# EAGLE design scanner154 (EAGLE 6.5.0)
AUTHOR: Brad Campbell; REV: A; TITLE: Scanner 15.4
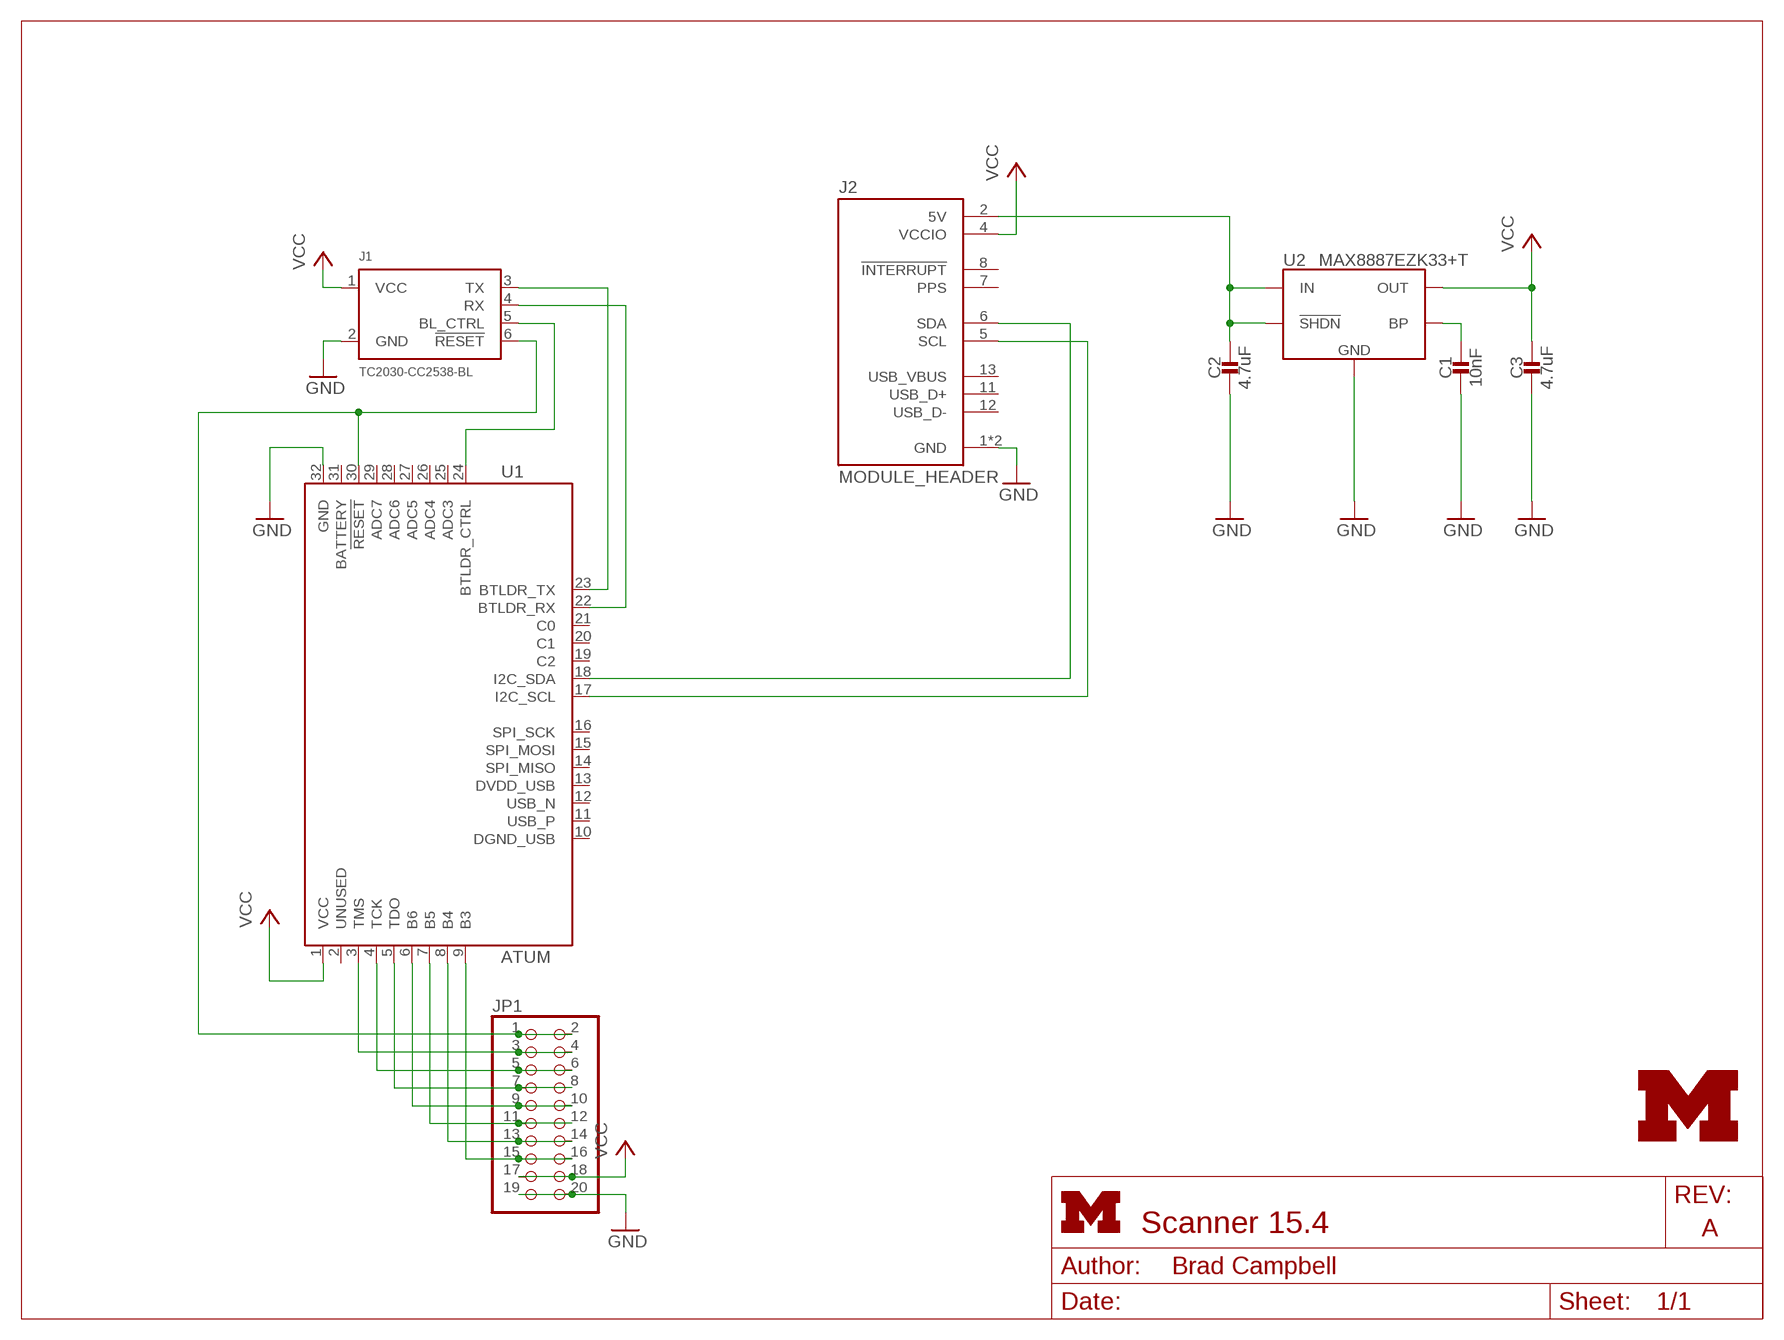
[diagram p0: schematic, sheet 1]
FRAME1 (LETTER_L): HEIGHT: 8.5in; WIDTH: 11in

## Parts
C1  10nF  CAPACITOR0603_CAP  [0603_CAP]
C2  4.7uF  CAPACITOR0603_CAP  [0603_CAP]
C3  4.7uF  CAPACITOR0603_CAP  [0603_CAP]
J1  TC2030-CC2538-BL  [TC2030-IDC]
J2  MODULE_HEADER  [HEADER_14PIN]
JP1  PINHD-2X10  [2X10]
LOGO2  UMICH_SOLID_HUGE  [UMICH_SOLID_500MIL]
U1  ATUM  [ATUM]
U2  MAX8887EZK33+T  [SOT-23-5]

## Nets
5V: C2.1 J2.2(5V) U2.1(IN) U2.3(!SHDN)
!RESET: J1.6(!RESET) JP1.1 JP1.2 U1.30(!RESET)
B3: JP1.15 JP1.16 U1.9(B3)
B4: JP1.13 JP1.14 U1.8(B4)
B5: JP1.11 JP1.12 U1.7(B5)
B6: JP1.9 JP1.10 U1.6(B6)
GND: C1.2 C2.2 C3.2 J1.2(GND) J2.1(GND) J2.14(GND) JP1.19 JP1.20 U1.32(GND) U2.2(GND)
N$5: J1.3(TX) U1.23(BTLDR_TX)
N$6: J1.4(RX) U1.22(BTLDR_RX)
N$7: J1.5(BL_CTRL) U1.24(BTLDR_CTRL)
N$11: C1.1 U2.4(BP)
SCL: J2.5(SCL) U1.17(I2C_SCL)
SDA: J2.6(SDA) U1.18(I2C_SDA)
TCK: JP1.5 JP1.6 U1.4(TCK)
TDO: JP1.7 JP1.8 U1.5(TDO)
TMS: JP1.3 JP1.4 U1.3(TMS)
VCC: C3.1 J1.1(VCC) J2.4(VCCIO) JP1.17 JP1.18 U1.1(VCC) U2.5(OUT)
Unconnected: J2.7(PPS) J2.8(!INTERRUPT) J2.11(USB_D+) J2.12(USB_D-) J2.13(USB_VBUS) U1.2(UNUSED) U1.10(DGND_USB) U1.11(USB_P) U1.12(USB_N) U1.13(DVDD_USB) U1.14(SPI_MISO) U1.15(SPI_MOSI) U1.16(SPI_SCK) U1.19(C2) U1.20(C1) U1.21(C0) U1.25(ADC3) U1.26(ADC4) U1.27(ADC5) U1.28(ADC6) U1.29(ADC7) U1.31(BATTERY)

## Library data of the parts
C1 = passives:CAPACITOR: 0402 Capacitor; DIGIKEY: 490-1512-1-ND
C2 C3 = passives:CAPACITOR: 0402 Capacitor; DIGIKEY: 490-3297-1-ND
J1 = connector:TC2030-CC2538-BL: Tag connect programmer for the CC2538 bootloader. The RX/TX switch happens on the programmer board, so when using this connect the TX pin to the TX pin on the CC2538 and same for the RX.
J2 = signpost:MODULE_HEADER: Header for signpost modules; DIGIKEY: S9170-ND
JP1 = pinhead:PINHD-2X10: PIN HEADER
LOGO2 = logos:UMICH_SOLID
U1 = atum:ATUM: Atum sensorboard prototyping module.
U2 = chips:MAX8887: IC REG LDO 3.3V 0.3A TSOT23-5; DIGIKEY: MAX8887EZK33+TCT-ND

## Board
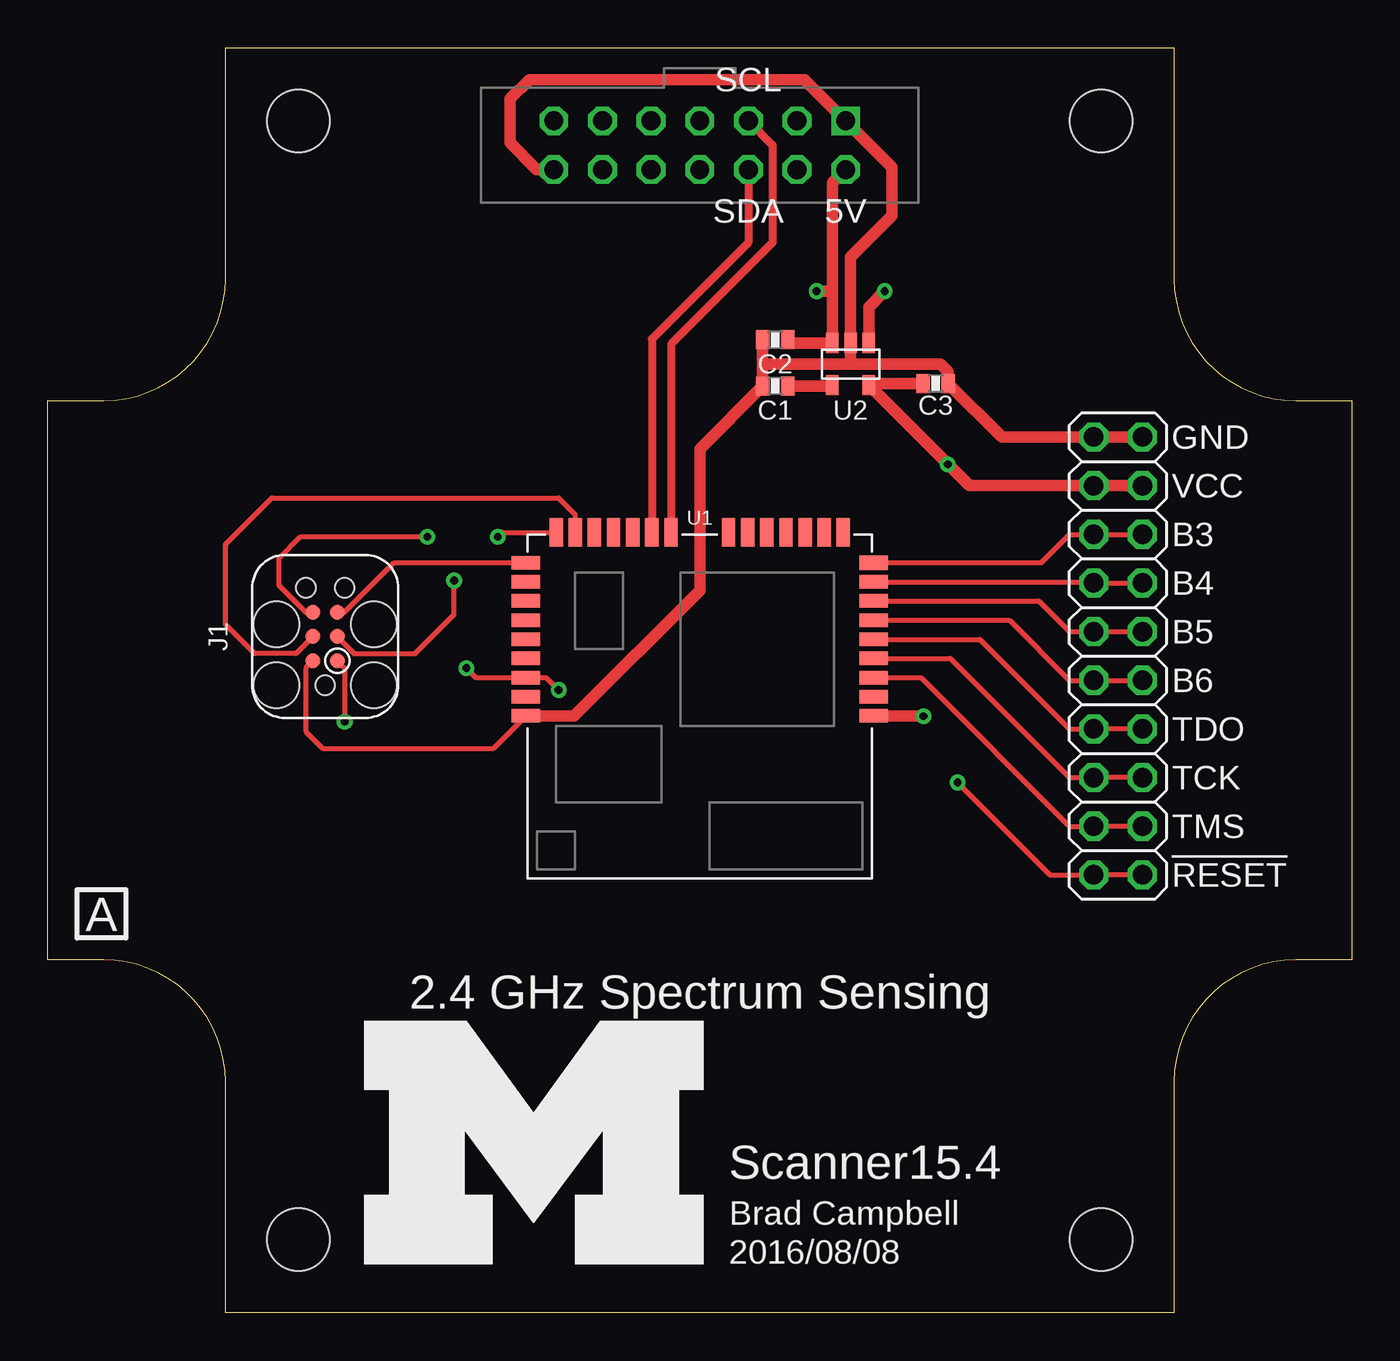
[diagram p1: board, top side]
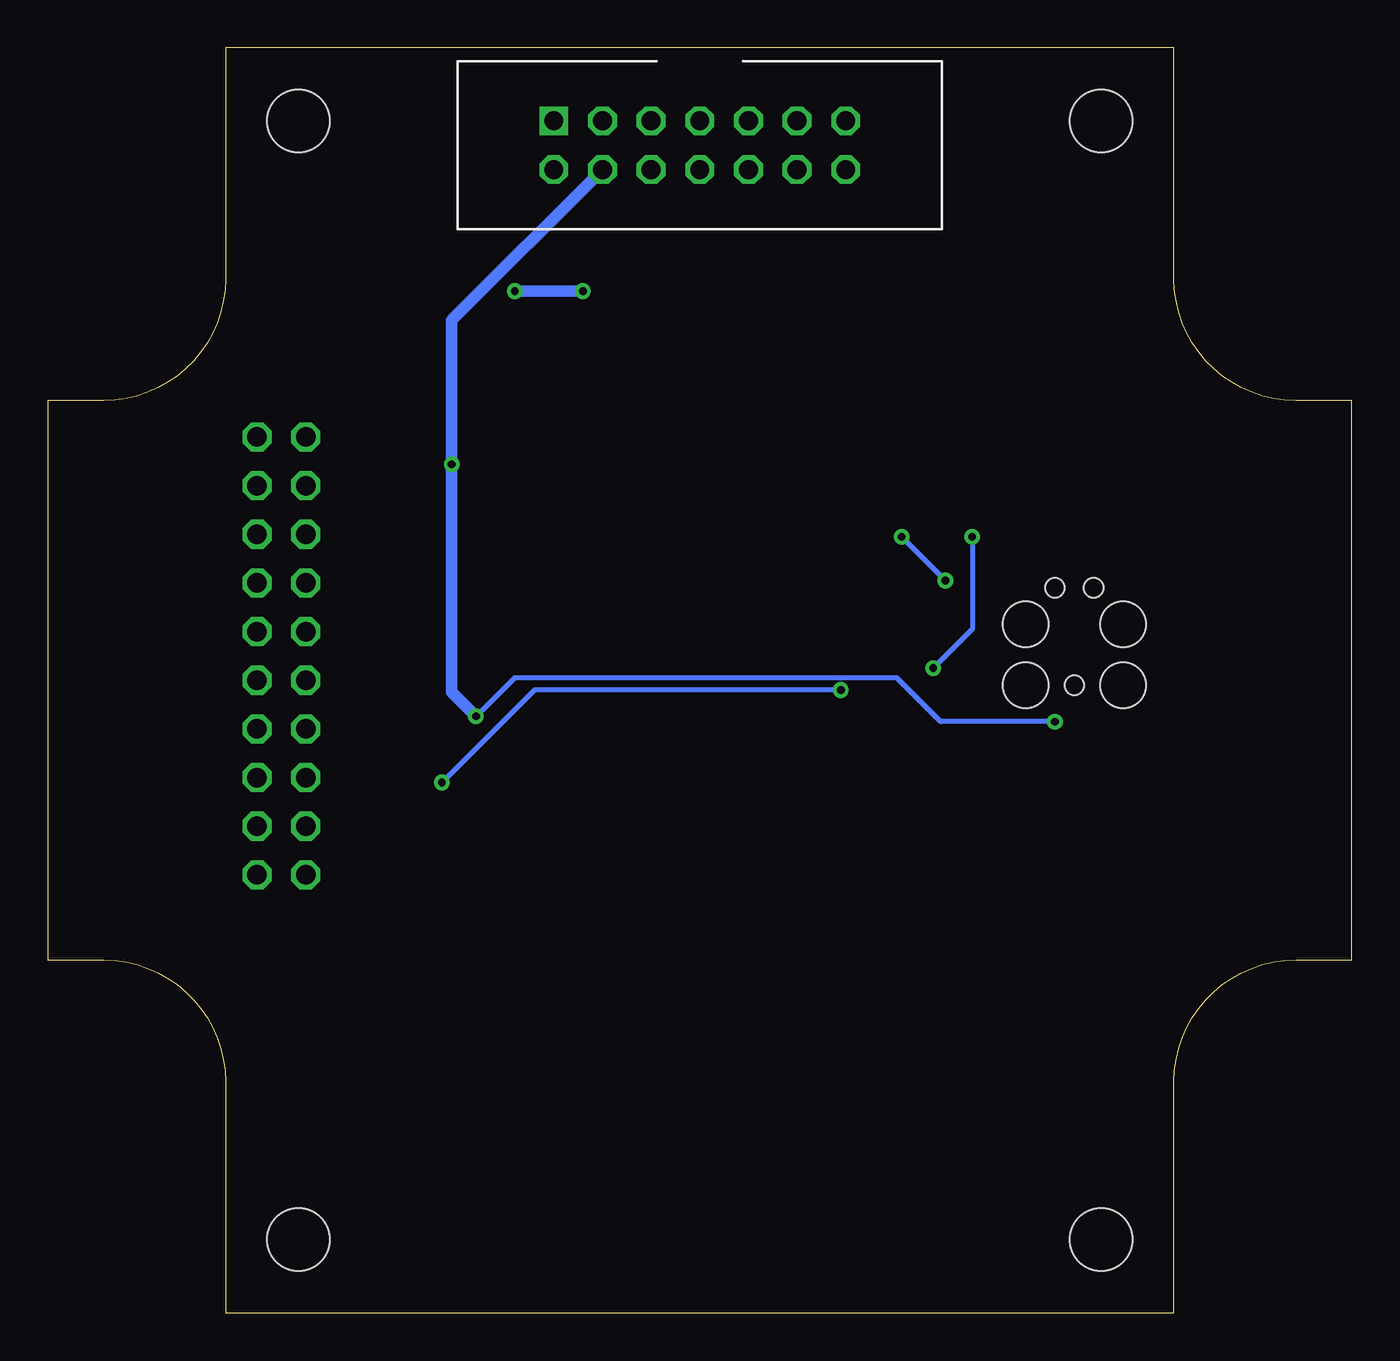
[diagram p2: board, bottom side, seen from below]

Size 68.07 x 66.04 mm. Coordinates in mm from the lower left corner, seen from the top.
Outline: 9.27,0 9.27,12.06 arc90 2.92,18.41 0,18.41 0,47.62 2.92,47.62 arc90 9.27,53.98 9.27,66.04 58.8,66.04 58.8,53.98 arc90 65.15,47.62 68.07,47.62 68.07,18.41 65.15,18.41 arc90 58.8,12.06 58.8,0 9.27,0
Copper layers (1*16): Top 0.035mm / dielectric 1.5mm / Bottom 0.035mm
Design rules "default": minimum track width 10mil, minimum drill 24mil, track to track 8mil, track to pad 8mil, pad to pad 8mil, via to via 8mil, smd to smd 8mil, copper to edge 40mil, drill to drill 8mil, minimum pad ring 10mil, minimum via ring 8mil, stop-mask expansion 4mil, vias tented up to drill 0mil, thermal gap 10mil
Holes 3.26 mm at 13.08,62.23 54.99,62.23 13.08,3.81 54.99,3.81

### Footprints (pad centres in the part's own frame; a part is rotated, then mirrored left to right if it is on the bottom)
0603_CAP = smd 0.7 x 1: 1 -0.65,0; 2 0.65,0
TC2030-IDC = smd 0.787 x 0.787: 1 -1.27,-0.635; 2 -1.27,0.635; 3 0,-0.635; 4 0,0.635; 5 1.27,-0.635; 6 1.27,0.635 | hole 2.375: -2.54,2.54; 0.635,2.54; 0.635,-2.54; -2.54,-2.54 | hole 1.016: -2.54,0; 2.54,1.016; 2.54,-1.016
HEADER_14PIN = drill 0.991 square: 1 7.62,1.27 | drill 0.991 octagon: 2 7.62,-1.27; 3 5.08,1.27; 4 5.08,-1.27; 5 2.54,1.27; 6 2.54,-1.27; 7 0,1.27; 8 0,-1.27; 9 -2.54,1.27; 10 -2.54,-1.27; 11 -5.08,1.27; 12 -5.08,-1.27; 13 -7.62,1.27; 14 -7.62,-1.27
2X10 = drill 1.016 octagon: 1 -11.43,-1.27; 2 -11.43,1.27; 3 -8.89,-1.27; 4 -8.89,1.27; 5 -6.35,-1.27; 6 -6.35,1.27; 7 -3.81,-1.27; 8 -3.81,1.27; 9 -1.27,-1.27; 10 -1.27,1.27; 11 1.27,-1.27; 12 1.27,1.27; 13 3.81,-1.27; 14 3.81,1.27; 15 6.35,-1.27; 16 6.35,1.27; 17 8.89,-1.27; 18 8.89,1.27; 19 11.43,-1.27; 20 11.43,1.27
ATUM = smd 0.7 x 1.5: 1 -9.479,-9.079; 2 -8.479,-9.079; 3 -7.479,-9.079; 4 -6.479,-9.079; 5 -5.479,-9.079; 6 -4.479,-9.079; 7 -3.479,-9.079; 8 -2.479,-9.079; 24 -1.479,9.079; 25 -2.479,9.079; 26 -3.479,9.079; 27 -4.479,9.079; 28 -5.479,9.079; 29 -6.479,9.079; 30 -7.479,9.079; 31 -8.479,9.079; 32 -9.479,9.079 | smd 0.754 x 1.5: 9 -1.479,-9.079 | smd 1.5 x 0.7: 10 0.1,-7.5; 11 0.1,-6.5; 12 0.1,-5.5; 13 0.1,-4.5; 14 0.1,-3.5; 15 0.1,-2.5; 16 0.1,-1.5; 17 0.1,1.5; 18 0.1,2.5; 19 0.1,3.5; 20 0.1,4.5; 21 0.1,5.5; 22 0.1,6.5; 23 0.1,7.5
SOT-23-5 = smd 0.65 x 1.06: 1 -0.95,-1.1; 2 0,-1.1; 3 0.95,-1.1; 4 0.95,1.1; 5 -0.95,1.1

### Placement (x,y rotation side)
C1  37.97,48.39 180 top
C2  37.97,50.8 180 top
C3  46.35,48.51 0 top
J1  14.48,35.31 90 top
J2  34.04,60.96 0 top
JP1  55.88,34.29 90 top
LOGO2  16.51,2.54 0 top
U1  34.04,40.64 90 top
U2  41.91,49.53 180 top

### Tracks (layer width: path | path; a pad name or v marks a point on that pad's centre or on a via)
5V  (via drill 0.41)
  Top 0.61: J2.2 40.96,58.99 40.96,53.34 | 40.96,53.34 U2.3 38.79,50.63 C2.1 | U2.1 42.86,52.51 v43.69,53.34 | v40.13,53.34 40.96,53.34
  Bottom 0.61: v43.69,53.34 v40.13,53.34
!RESET  (via drill 0.41)
  Top 0.254: J1.6 13.46,36.58 12.06,37.97 12.06,39.37 13.21,40.51 v19.81,40.51 | v21.84,33.66 22.34,33.16 U1.30 26.02,33.16 v26.67,32.51 | v47.5,27.69 52.32,22.86 JP1.2 JP1.1
  Bottom 0.254: v19.81,40.51 19.81,35.69 v21.84,33.66 | v26.67,32.51 42.67,32.51 v47.5,27.69
B3
  Top 0.254: U1.9 51.86,39.16 53.34,40.64 JP1.16 JP1.15
B4
  Top 0.254: U1.8 54.55,38.16 JP1.14 JP1.13
B5
  Top 0.254: U1.7 51.74,37.16 53.34,35.56 JP1.12 JP1.11
B6
  Top 0.254: U1.6 50.2,36.16 53.34,33.02 JP1.10 JP1.9
GND
  Top 0.254: J1.2 13.46,33.66 13.46,30.35 14.35,29.46 23.26,29.46 U1.32
  Top 0.61: U1.32 27.48,31.16 34.04,37.72 34.04,45.1 C1.2 37.32,49.53 | C2.2 37.32,49.53 | 41.91,49.53 46.61,49.53 47.01,49.13 C3.2 49.8,45.72 JP1.20 JP1.19 | 41.91,49.53 37.32,49.53 | J2.14 25.53,59.69 24.13,61.09 24.13,63.37 25.15,64.39 39.5,64.39 J2.1 44.07,59.82 44.07,57.28 41.91,55.12 U2.2 41.91,49.53
N$5  (via drill 0.41)
  Top 0.254: J1.3 16,34.42 19.18,34.42 21.21,36.45 v21.21,38.23 | v23.5,40.51 23.72,40.74 U1.23
  Bottom 0.254: v21.21,38.23 v23.5,40.51
N$6
  Top 0.254: J1.4 12.95,34.42 10.79,34.42 9.27,35.94 9.27,40.13 11.68,42.55 26.67,42.55 27.54,41.68 U1.22
N$7
  Top 0.254: J1.5 15.49,36.58 18.08,39.16 U1.24
N$11
  Top 0.61: U2.4 40.92,48.39 C1.1
SCL
  Top 0.406: J2.5 37.85,60.96 37.85,55.88 32.54,50.57 U1.17
SDA
  Top 0.406: J2.6 36.58,55.88 31.54,50.84 U1.18
TCK
  Top 0.254: U1.4 47.12,34.16 53.34,27.94 JP1.6 JP1.5
TDO
  Top 0.254: U1.5 48.66,35.16 53.34,30.48 JP1.8 JP1.7
TMS
  Top 0.254: JP1.3 JP1.4 53.34,25.4 45.58,33.16 U1.3
VCC  (via drill 0.41)
  Top 0.254: J1.1 15.49,33.66 v15.49,30.86
  Top 0.61: C3.1 42.94,48.51 U2.5 v46.99,44.3 48.11,43.18 JP1.18 JP1.17 | U1.1 45.7,31.16 v45.72,31.14
  Bottom 0.254: v15.49,30.86 21.46,30.86 23.75,33.15 43.71,33.15 v45.72,31.14
  Bottom 0.61: J2.4 46.99,51.82 v46.99,44.3 46.99,32.41 v45.72,31.14

### Text on the board
tPlace: SCL | SDA | 5V | GND | VCC | B3 | B4 | B5 | B6 | TDO | TCK | TMS | !RESET | A | 2.4 GHz Spectrum Sensing | Scanner15.4 | Brad Campbell | 2016/08/08